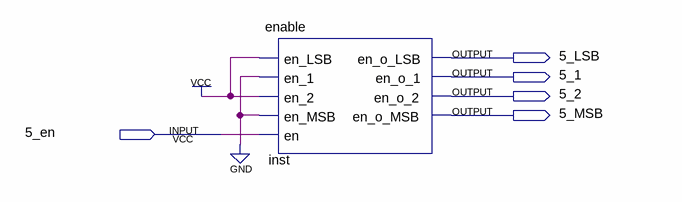
[diagram p0: schematic sheet]
// Quartus schematic 5_en.bdf as structural Verilog: 1 symbols, 5 pins
module \5_en  (
  input  \5_en ,
  output \5_LSB ,
  output \5_1 ,
  output \5_2 ,
  output \5_MSB 
);

  enable inst (
    .en_LSB(1'b1), .en_1(1'b0), .en_2(1'b1), .en_MSB(1'b0), .en(\5_en ), .en_o_LSB(\5_LSB ), .en_o_1(\5_1 ),
    .en_o_2(\5_2 ), .en_o_MSB(\5_MSB ));
endmodule
